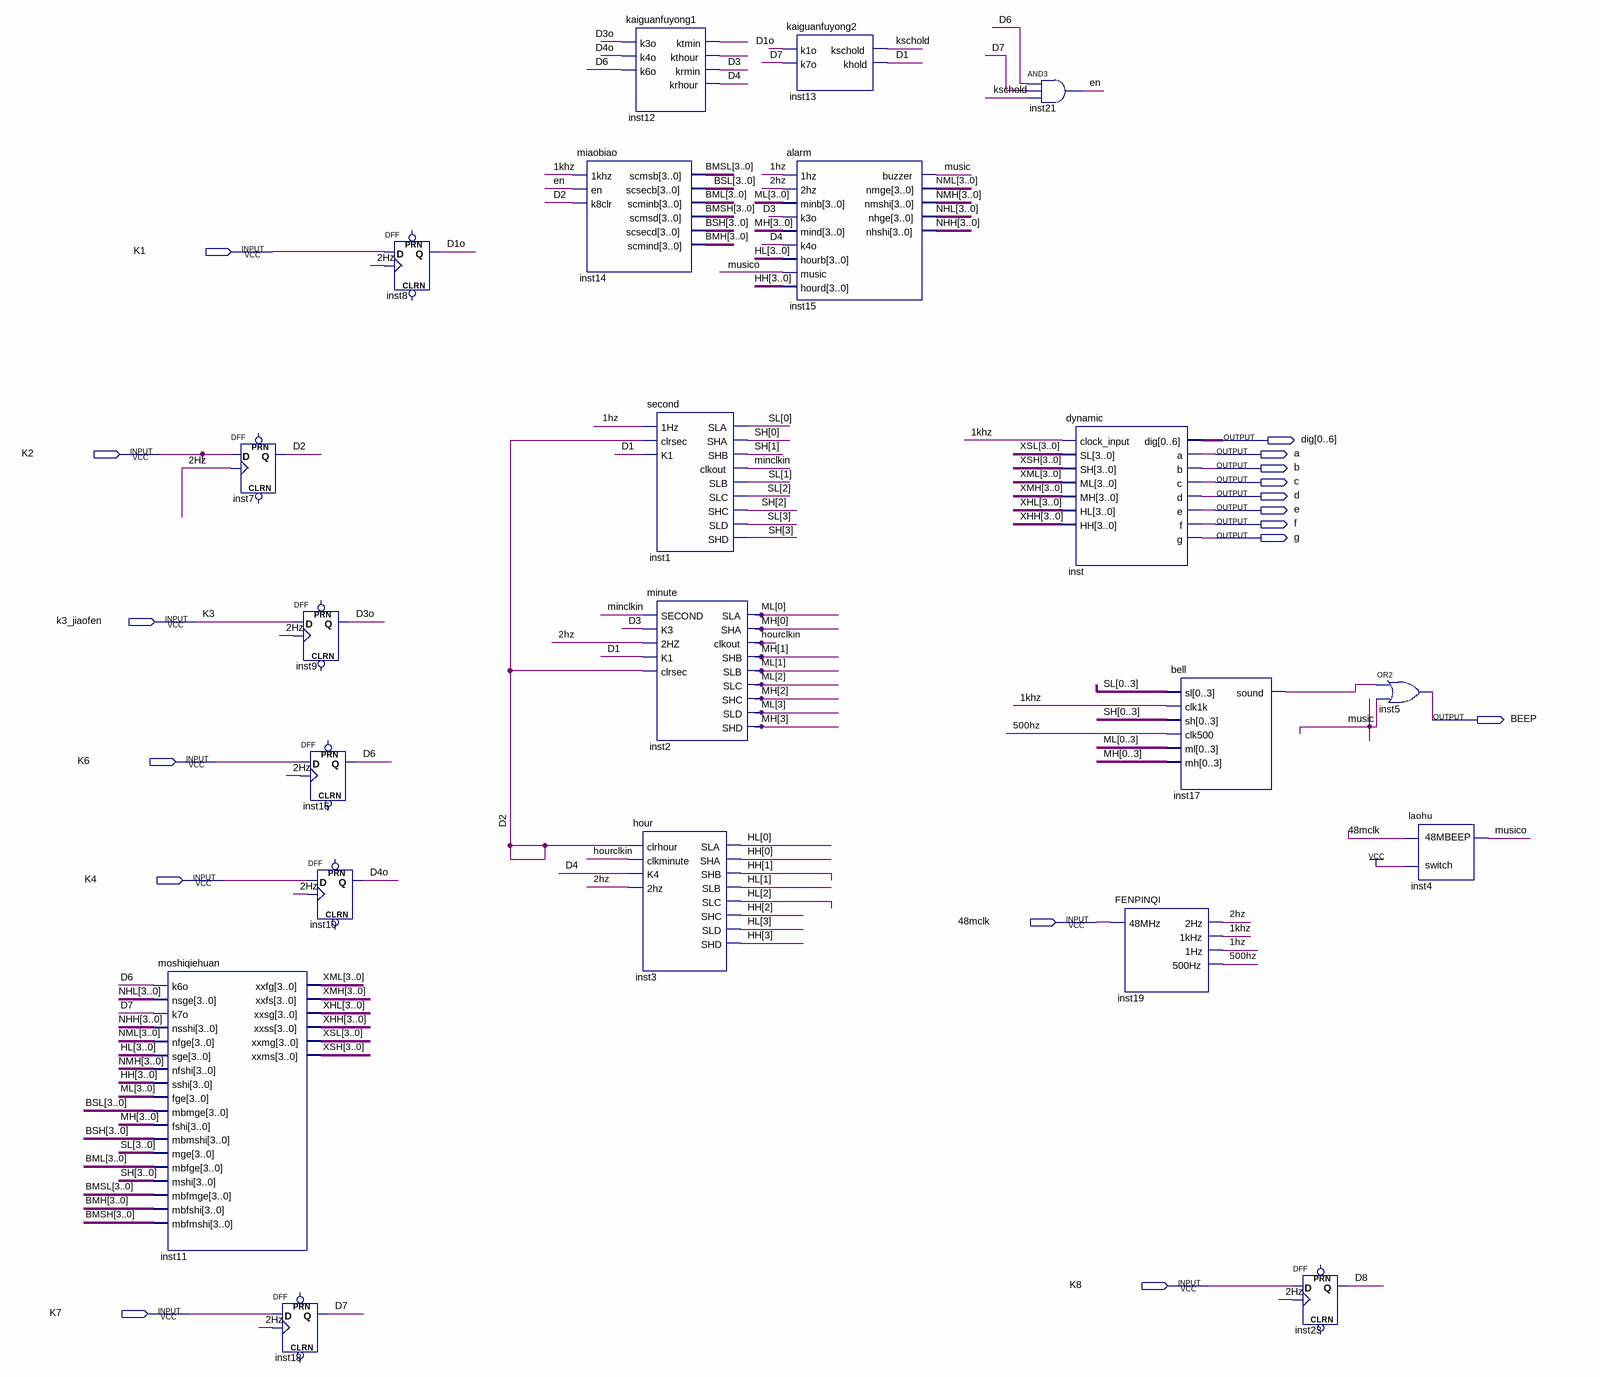
[diagram p0: schematic sheet]
// Quartus schematic ALL.bdf as structural Verilog: 21 symbols, 17 pins
module ALL (
  input  K1,
  input  K2,
  input  k3_jiaofen,
  input  K6,
  input  K4,
  input  \48mclk ,
  input  K8,
  input  K7,
  output [0:6] dig,
  output a,
  output b,
  output c,
  output d,
  output e,
  output f,
  output g,
  output BEEP
);

  wire \1hz , \1khz , \2hz , \500hz , D1, D1o, D2, D3, D3o, D4, D4o, D6, D7, D8, en, hourclkin,
       inst12_kthour, inst12_ktmin, inst17_sound, kschold, minclkin, music, musico;
  wire [3:0] BMH, BML, BMSH, BMSL, BSH, BSL, HH, HL, MH, ML, NHH, NHL, NMH, NML, SH, SL, XHH, XHL, XMH, XML,
       XSH, XSL;

  moshiqiehuan inst11 (
    .k6o(D6), .nsge(NHL), .k7o(D7), .nsshi(NHH), .nfge(NML), .sge(HL), .nfshi(NMH), .sshi(HH), .fge(ML),
    .mbmge(BSL), .fshi(MH), .mbmshi(BSH), .mge(SL), .mbfge(BML), .mshi(SH), .mbfmge(BMSL), .mbfshi(BMH),
    .mbfmshi(BMSH), .xxfg(XML), .xxfs(XMH), .xxsg(XHL), .xxss(XHH), .xxmg(XSL), .xxms(XSH));
  DFF inst7 (.CLK(\2hz ), .D(K2), .Q(D2));  // open: CLRN, PRN
  DFF inst9 (.CLK(\2hz ), .D(k3_jiaofen), .Q(D3o));  // open: CLRN, PRN
  DFF inst16 (.CLK(\2hz ), .D(K6), .Q(D6));  // open: CLRN, PRN
  DFF inst10 (.CLK(\2hz ), .D(K4), .Q(D4o));  // open: CLRN, PRN
  DFF inst18 (.CLK(\2hz ), .D(K7), .Q(D7));  // open: CLRN, PRN
  DFF inst8 (.CLK(\2hz ), .D(K1), .Q(D1o));  // open: CLRN, PRN
  miaobiao inst14 (
    .\1khz (\1khz ), .en(en), .k8clr(D2), .scmsb(BMSL), .scsecb(BSL), .scminb(BML), .scmsd(BMSH),
    .scsecd(BSH), .scmind(BMH));
  kaiguanfuyong1 inst12 (
    .k3o(D3o), .k4o(D4o), .k6o(D6), .ktmin(inst12_ktmin), .kthour(inst12_kthour), .krmin(D3), .krhour(D4));
  second inst1 (
    .\1Hz (\1hz ), .clrsec(D2), .K1(D1), .SLA(SL[0]), .SHA(SH[0]), .SHB(SH[1]), .clkout(minclkin),
    .SLB(SL[1]), .SLC(SL[2]), .SHC(SH[2]), .SLD(SL[3]), .SHD(SH[3]));
  minute inst2 (
    .SECOND(minclkin), .K3(D3), .\2HZ (\2hz ), .K1(D1), .clrsec(D2), .SLA(ML[0]), .SHA(MH[0]),
    .clkout(hourclkin), .SHB(MH[1]), .SLB(ML[1]), .SLC(ML[2]), .SHC(MH[2]), .SLD(ML[3]), .SHD(MH[3]));
  hour inst3 (
    .clrhour(D2), .clkminute(hourclkin), .K4(D4), .\2hz (\2hz ), .SLA(HL[0]), .SHA(HH[0]), .SHB(HH[1]),
    .SLB(HL[1]), .SLC(HL[2]), .SHC(HH[2]), .SLD(HL[3]), .SHD(HH[3]));
  kaiguanfuyong2 inst13 (.k1o(D1o), .k7o(D7), .kschold(kschold), .khold(D1));
  alarm inst15 (
    .\1hz (\1hz ), .\2hz (\2hz ), .minb(ML), .k3o(D3), .mind(MH), .k4o(D4), .hourb(HL), .music(musico),
    .hourd(HH), .buzzer(music), .nmge(NML), .nmshi(NMH), .nhge(NHL), .nhshi(NHH));
  and inst21 (en, D6, D7, kschold);
  dynamic inst (
    .clock_input(\1khz ), .SL(XSL), .SH(XSH), .ML(XML), .MH(XMH), .HL(XHL), .HH(XHH), .dig(dig), .a(a),
    .b(b), .c(c), .d(d), .e(e), .f(f), .g(g));
  FENPINQI inst19 (.\48MHz (\48mclk ), .\2Hz (\2hz ), .\1kHz (\1khz ), .\1Hz (\1hz ), .\500Hz (\500hz ));
  bell inst17 (
    .sl({SL[0], SL[1], SL[2], SL[3]}), .clk1k(\1khz ), .sh({SH[0], SH[1], SH[2], SH[3]}), .clk500(\500hz ),
    .ml({ML[0], ML[1], ML[2], ML[3]}), .mh({MH[0], MH[1], MH[2], MH[3]}), .sound(inst17_sound));
  DFF inst23 (.CLK(\2hz ), .D(K8), .Q(D8));  // open: CLRN, PRN
  or inst5 (BEEP, inst17_sound, music);
  laohu inst4 (.\48M (\48mclk ), .switch(1'b1), .BEEP(musico));

  // Other names for the same wires on the sheet: K3 = k3_jiaofen
endmodule
